# EAGLE schematic zx-uniper-stm32f7 (EAGLE 7.6.0)
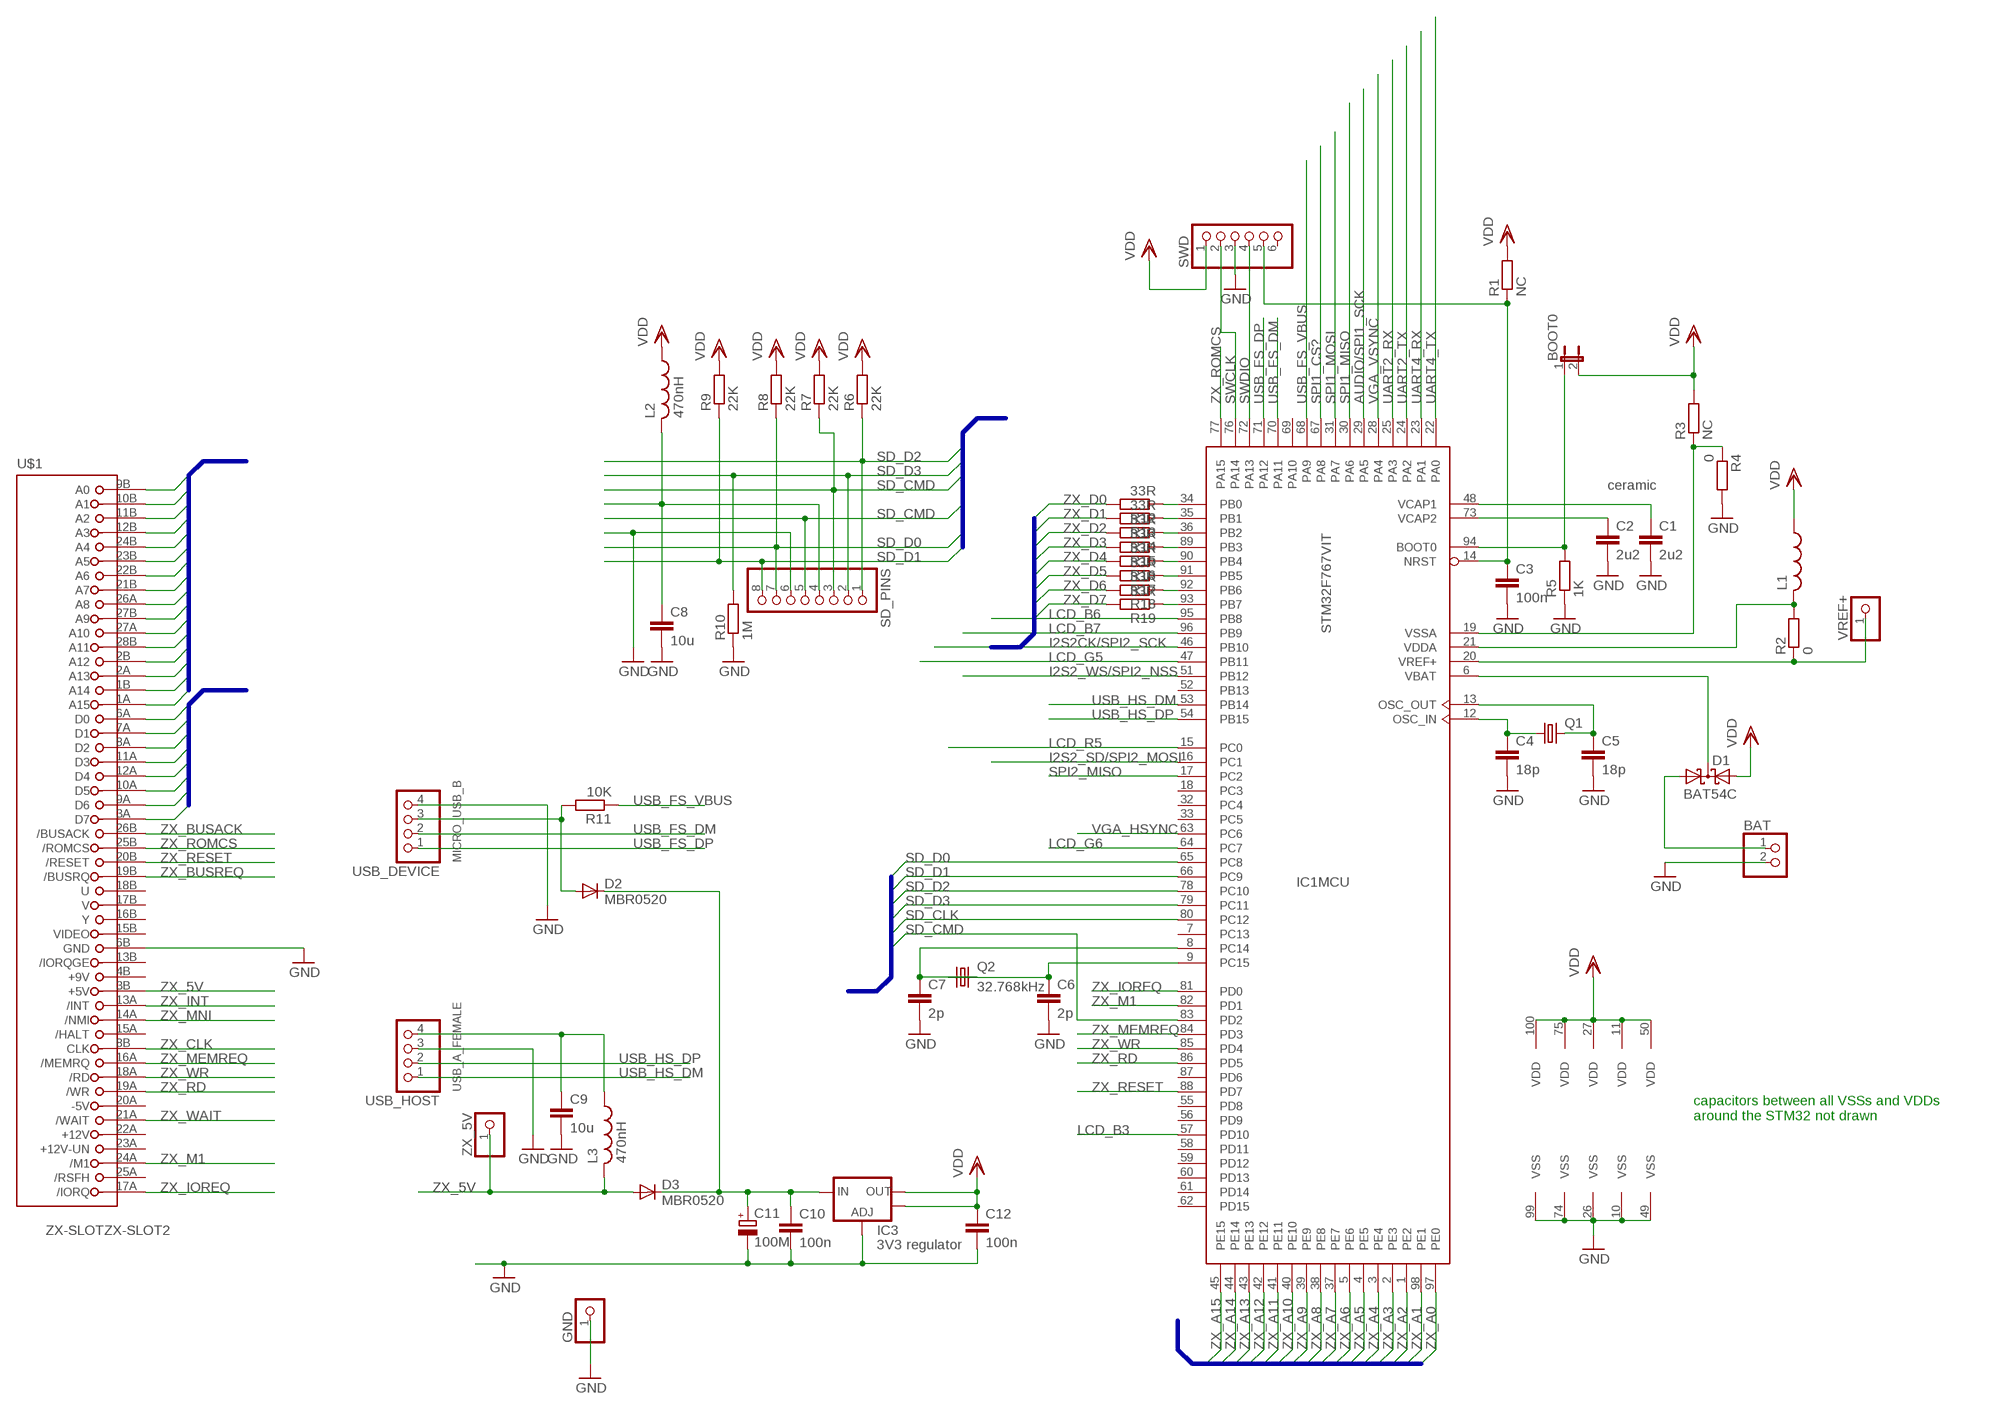
[diagram p0: schematic, sheet 1]

## Parts
BAT  PINHD-1X2  [1X02]
BOOT0  JP1E  [JP1]
C1  2u2  C-EUC0504  [C0504]
C2  2u2  C-EUC0504  [C0504]
C3  100n  C-EUC0504  [C0504]
C4  18p  C-EUC0504  [C0504]
C5  18p  C-EUC0504  [C0504]
C6  2p  C-EUC0504  [C0504]
C7  2p  C-EUC0504  [C0504]
C8  10u  C-EUC0504  [C0504]
C9  10u  C-EUC0504  [C0504]
C10  100n  C-EUC0504  [C0504]
C11  100M  CPOL-EUE  [PANASONIC_E]
C12  100n  C-EUC0504  [C0504]
D1  BAT54C  [SOT23]
D2  MBR0520  DIODE-SOD123  [SOD123]
D3  MBR0520  DIODE-SOD123  [SOD123]
GND  PINHD-1X1  [1X01]
IC1  STM32F767VIT  [LQFP100]
IC3  3V3 regulator  V_REG_LM1117SOT223  [SOT223]
L1  L-USL3225P  [L3225P]
L2  470nH  L-USL3225P  [L3225P]
L3  470nH  L-USL3225P  [L3225P]
Q1  CRYSTALSM49  [SM49]
Q2  32.768kHz  CRYSTALTC38H  [TC38H]
R1  NC  R-EU_R0805  [R0805]
R2  0  R-EU_R0805  [R0805]
R3  NC  R-EU_R0805  [R0805]
R4  0  R-EU_R0805  [R0805]
R5  1K  R-EU_R0805  [R0805]
R6  22K  R-EU_R0805  [R0805]
R7  22K  R-EU_R0805  [R0805]
R8  22K  R-EU_R0805  [R0805]
R9  22K  R-EU_R0805  [R0805]
R10  1M  R-EU_R0805  [R0805]
R11  10K  R-EU_R0805  [R0805]
R12  33R  R-EU_R0805  [R0805]
R13  33R  R-EU_R0805  [R0805]
R14  33R  R-EU_R0805  [R0805]
R15  33R  R-EU_R0805  [R0805]
R16  33R  R-EU_R0805  [R0805]
R17  33R  R-EU_R0805  [R0805]
R18  33R  R-EU_R0805  [R0805]
R19  33R  R-EU_R0805  [R0805]
SD_PINS  PINHD-1X8  [1X08]
SWD  PINHD-1X6  [1X06]
U$1  ZX-SLOTZX-SLOT2  [ZXCONECT2]
USB_DEVICE  PINHD-1X4  [1X04]
USB_HOST  PINHD-1X4  [1X04]
VREF+  PINHD-1X1  [1X01]
ZX_5V  PINHD-1X1  [1X01]

## Nets
AUDIO/SPI1_SCK: IC1.29(MCU:PA5)
GND: BAT.2 C1.2 C2.2 C3.2 C4.2 C5.2 C6.2 C7.2 C8.2 C9.2 C10.2 C11.- C12.2 GND.1 IC1.10(VSS) IC1.26(VSS) IC1.49(VSS) IC1.74(VSS) IC1.99(VSS) IC3.1(ADJ) R4.2 R5.1 R10.1 SD_PINS.6 SWD.3 U$1.6B(GND) USB_DEVICE.4 USB_HOST.3
I2S2_SD/SPI2_MOSI: IC1.16(MCU:PC1)
I2S2_WS/SPI2_NSS: IC1.51(MCU:PB12)
I2S2CK/SPI2_SCK: IC1.46(MCU:PB10)
LCD_B3: IC1.57(MCU:PD10)
LCD_B6: IC1.95(MCU:PB8)
LCD_B7: IC1.96(MCU:PB9)
LCD_G5: IC1.47(MCU:PB11)
LCD_G6: IC1.64(MCU:PC7)
LCD_R5: IC1.15(MCU:PC0)
N$1: IC1.20(MCU:VREF+) R2.1 VREF+.1
N$2: IC1.21(MCU:VDDA) L1.2 R2.2
N$3: C1.1 IC1.48(MCU:VCAP1)
N$4: C2.1 IC1.73(MCU:VCAP2)
N$5: IC1.19(MCU:VSSA) R3.1 R4.1
N$6: BOOT0.1 IC1.94(MCU:BOOT0) R5.2
N$7: C4.1 IC1.12(MCU:OSC_IN) Q1.1
N$8: C5.1 IC1.13(MCU:OSC_OUT) Q1.2
N$9: C6.1 IC1.9(MCU:PC15) Q2.1
N$10: C7.1 IC1.8(MCU:PC14) Q2.2
N$11: D1.3(CC) IC1.6(MCU:VBAT)
N$12: BAT.1 D1.1(A1)
N$13: C8.1 L2.2 SD_PINS.4
N$14: C10.1 C11.+ D2.C D3.C IC3.3(IN)
N$15: IC1.34(MCU:PB0) R12.1
N$16: IC1.35(MCU:PB1) R13.1
N$17: IC1.36(MCU:PB2) R14.1
N$18: IC1.89(MCU:PB3) R15.1
N$19: IC1.90(MCU:PB4) R16.1
N$20: IC1.91(MCU:PB5) R17.1
N$21: IC1.92(MCU:PB6) R18.1
N$22: IC1.93(MCU:PB7) R19.1
NRST: C3.1 IC1.14(MCU:NRST) R1.1 SWD.5
SD_CLK: IC1.80(MCU:PC12) SD_PINS.5
SD_CMD: IC1.83(MCU:PD2) R7.1 SD_PINS.3
SD_D0: IC1.65(MCU:PC8) R8.1 SD_PINS.7
SD_D1: IC1.66(MCU:PC9) R9.1 SD_PINS.8
SD_D2: IC1.78(MCU:PC10) R6.1 SD_PINS.1
SD_D3: IC1.79(MCU:PC11) R10.2 SD_PINS.2
SPI1_CS?: IC1.67(MCU:PA8)
SPI1_MISO: IC1.30(MCU:PA6)
SPI1_MOSI: IC1.31(MCU:PA7)
SPI2_MISO: IC1.17(MCU:PC2)
SWCLK: IC1.76(MCU:PA14) SWD.2
SWDIO: IC1.72(MCU:PA13) SWD.4
UART2_RX: IC1.25(MCU:PA3)
UART2_TX: IC1.24(MCU:PA2)
UART4_RX: IC1.23(MCU:PA1)
UART4_TX: IC1.22(MCU:PA0)
USB0_VBUS_RAW: D2.A R11.2 USB_DEVICE.3
USB_FS_DM: IC1.70(MCU:PA11) USB_DEVICE.2
USB_FS_DP: IC1.71(MCU:PA12) USB_DEVICE.1
USB_FS_VBUS: IC1.68(MCU:PA9) R11.1
USB_HOST_5V: C9.1 L3.1 USB_HOST.4
USB_HS_DM: IC1.53(MCU:PB14) USB_HOST.1
USB_HS_DP: IC1.54(MCU:PB15) USB_HOST.2
VDD: BOOT0.2 C12.1 D1.2(A2) IC1.11(VDD) IC1.27(VDD) IC1.50(VDD) IC1.75(VDD) IC1.100(VDD) IC3.2(OUT) IC3.4(OUT) L1.1 L2.1 R1.2 R3.2 R6.2 R7.2 R8.2 R9.2 SWD.1
VGA_HSYNC: IC1.63(MCU:PC6)
VGA_VSYNC: IC1.28(MCU:PA4)
ZX_5V: D3.A L3.2 U$1.3B(+5V) ZX_5V.1
ZX_A0: IC1.97(MCU:PE0) U$1.9B(A0)
ZX_A1: IC1.98(MCU:PE1) U$1.10B(A1)
ZX_A2: IC1.1(MCU:PE2) U$1.11B(A2)
ZX_A3: IC1.2(MCU:PE3) U$1.12B(A3)
ZX_A4: IC1.3(MCU:PE4) U$1.24B(A4)
ZX_A5: IC1.4(MCU:PE5) U$1.23B(A5)
ZX_A6: IC1.5(MCU:PE6) U$1.22B(A6)
ZX_A7: IC1.37(MCU:PE7) U$1.21B(A7)
ZX_A8: IC1.38(MCU:PE8) U$1.26A(A8)
ZX_A9: IC1.39(MCU:PE9) U$1.27B(A9)
ZX_A10: IC1.40(MCU:PE10) U$1.27A(A10)
ZX_A11: IC1.41(MCU:PE11) U$1.28B(A11)
ZX_A12: IC1.42(MCU:PE12) U$1.2B(A12)
ZX_A13: IC1.43(MCU:PE13) U$1.2A(A13)
ZX_A14: IC1.44(MCU:PE14) U$1.1B(A14)
ZX_A15: IC1.45(MCU:PE15) U$1.1A(A15)
ZX_BUSACK: U$1.26B(/BUSACK)
ZX_BUSREQ: U$1.19B(/BUSRQ)
ZX_CLK: U$1.8B(CLK)
ZX_D0: R12.2 U$1.6A(D0)
ZX_D1: R13.2 U$1.7A(D1)
ZX_D2: R14.2 U$1.8A(D2)
ZX_D3: R15.2 U$1.11A(D3)
ZX_D4: R16.2 U$1.12A(D4)
ZX_D5: R17.2 U$1.10A(D5)
ZX_D6: R18.2 U$1.9A(D6)
ZX_D7: R19.2 U$1.3A(D7)
ZX_INT: U$1.13A(/INT)
ZX_IOREQ: IC1.81(MCU:PD0) U$1.17A(/IORQ)
ZX_M1: IC1.82(MCU:PD1) U$1.24A(/M1)
ZX_MEMREQ: IC1.84(MCU:PD3) U$1.16A(/MEMRQ)
ZX_MNI: U$1.14A(/NMI)
ZX_RD: IC1.86(MCU:PD5) U$1.19A(/WR)
ZX_RESET: IC1.88(MCU:PD7) U$1.20B(/RESET)
ZX_ROMCS: IC1.77(MCU:PA15) U$1.25B(/ROMCS)
ZX_WAIT: U$1.21A(/WAIT)
ZX_WR: IC1.85(MCU:PD4) U$1.18A(/RD)
Unconnected: IC1.7(MCU:PC13) IC1.18(MCU:PC3) IC1.32(MCU:PC4) IC1.33(MCU:PC5) IC1.52(MCU:PB13) IC1.55(MCU:PD8) IC1.56(MCU:PD9) IC1.58(MCU:PD11) IC1.59(MCU:PD12) IC1.60(MCU:PD13) IC1.61(MCU:PD14) IC1.62(MCU:PD15) IC1.69(MCU:PA10) IC1.87(MCU:PD6) SWD.6 U$1.4B(+9V) U$1.13B(/IORQGE) U$1.15A(/HALT) U$1.15B(VIDEO) U$1.16B(Y) U$1.17B(V) U$1.18B(U) U$1.20A(-5V) U$1.22A(+12V) U$1.23A(+12V-UN) U$1.25A(/RSFH)

## Buses
SD_D0,SD_D1,SD_D2,SD_D3,SD_CLK,SD_CMD
ZX_D[0..7]
ZX_A[0..15]

## Notes on the sheet
- ceramic
- MICRO_USB_B
- USB_A_FEMALE
- capacitors between all VSSs and VDDs 
  around the STM32 not drawn

## Library data of the parts
BAT = pinhead+:PINHD-1X2: PIN HEADER
BOOT0 = jumper:JP1E: JUMPER
C1-C10 C12 = rcl:C-EU: CAPACITOR, European symbol
C11 = rcl:CPOL-EU: POLARIZED CAPACITOR, European symbol
D1 = diode:BAT54C: Schottky Diodes Source: Fairchild .. BAT54.pdf
D2 D3 = diode:DIODE-: DIODE
GND VREF+ ZX_5V = pinhead:PINHD-1X1: PIN HEADER
IC1 = micro-stm_v3:STM32F767VIT: ARM 32-bit Cortex™-M7 CPU
IC3 = SparkFun:V_REG_LM1117: Voltage Regulator LM1117 Standard adjustable voltage regulator but in SMD form. Spark Fun Electronics SKU : COM-00595
L1-L3 = rcl:L-US: INDUCTOR, American symbol
Q1 Q2 = crystal:CRYSTAL: CRYSTAL; OC_FARNELL: unknown; OC_NEWARK: unknown
R1-R19 = rcl:R-EU_: RESISTOR, European symbol
SD_PINS = pinhead:PINHD-1X8: PIN HEADER
SWD = pinhead:PINHD-1X6: PIN HEADER
U$1 = Zx-Conect:ZX-SLOT: Conector ZX-Spectrum Diseñado por droy@mixmail.com para el trastero del Spectrum
USB_DEVICE USB_HOST = pinhead+:PINHD-1X4: PIN HEADER

## Net classes
1 power: width 0.406 mm